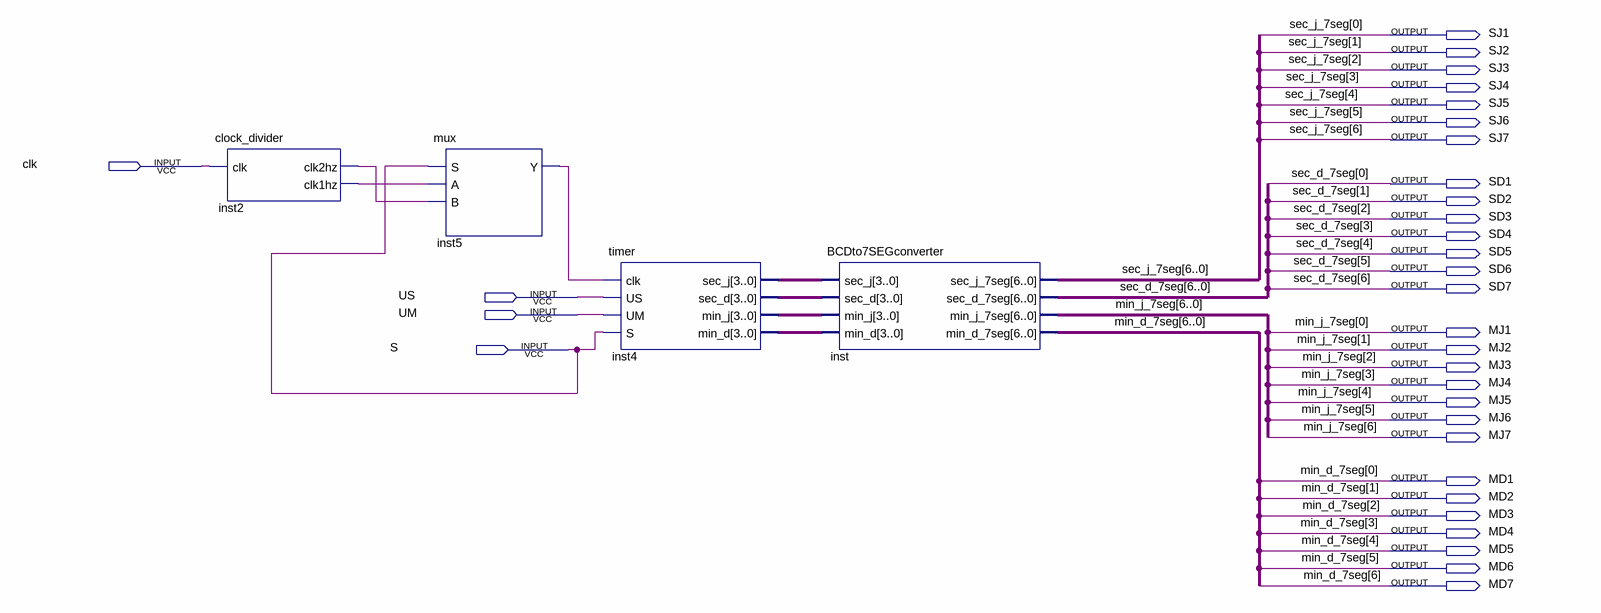
[diagram p0: schematic sheet]
// Quartus schematic timer_vhdl.bdf as structural Verilog: 4 symbols, 32 pins
module timer_vhdl (
  input  clk,
  input  US,
  input  UM,
  input  S,
  output SJ1,
  output SJ2,
  output SJ3,
  output SJ4,
  output SJ5,
  output SJ6,
  output SJ7,
  output SD1,
  output SD2,
  output SD3,
  output SD4,
  output SD5,
  output SD6,
  output SD7,
  output MJ1,
  output MJ2,
  output MJ3,
  output MJ4,
  output MJ5,
  output MJ6,
  output MJ7,
  output MD1,
  output MD2,
  output MD3,
  output MD4,
  output MD5,
  output MD6,
  output MD7
);

  wire inst2_clk1hz, inst2_clk2hz, inst5_y;
  wire [3:0] inst4_min_d, inst4_min_j, inst4_sec_d, inst4_sec_j;

  clock_divider inst2 (.clk(clk), .clk2hz(inst2_clk2hz), .clk1hz(inst2_clk1hz));
  mux inst5 (.S(S), .A(inst2_clk1hz), .B(inst2_clk2hz), .Y(inst5_y));
  timer inst4 (
    .clk(inst5_y), .US(US), .UM(UM), .S(S), .sec_j(inst4_sec_j), .sec_d(inst4_sec_d), .min_j(inst4_min_j),
    .min_d(inst4_min_d));
  BCDto7SEGconverter inst (
    .sec_j(inst4_sec_j), .sec_d(inst4_sec_d), .min_j(inst4_min_j), .min_d(inst4_min_d),
    .sec_j_7seg({SJ7, SJ6, SJ5, SJ4, SJ3, SJ2, SJ1}), .sec_d_7seg({SD7, SD6, SD5, SD4, SD3, SD2, SD1}),
    .min_j_7seg({MJ7, MJ6, MJ5, MJ4, MJ3, MJ2, MJ1}), .min_d_7seg({MD7, MD6, MD5, MD4, MD3, MD2, MD1}));

  // Other names for the same wires on the sheet: min_d_7seg[6:0] = {MD7, MD6, MD5, MD4, MD3, MD2, MD1};
  //   min_j_7seg[6:0] = {MJ7, MJ6, MJ5, MJ4, MJ3, MJ2, MJ1}; sec_d_7seg[6:0] = {SD7, SD6, SD5, SD4, SD3, SD2, SD1};
  //   sec_j_7seg[6:0] = {SJ7, SJ6, SJ5, SJ4, SJ3, SJ2, SJ1}
endmodule
